# Altium schematic sheet cpu2560-double.SchDoc
size A4
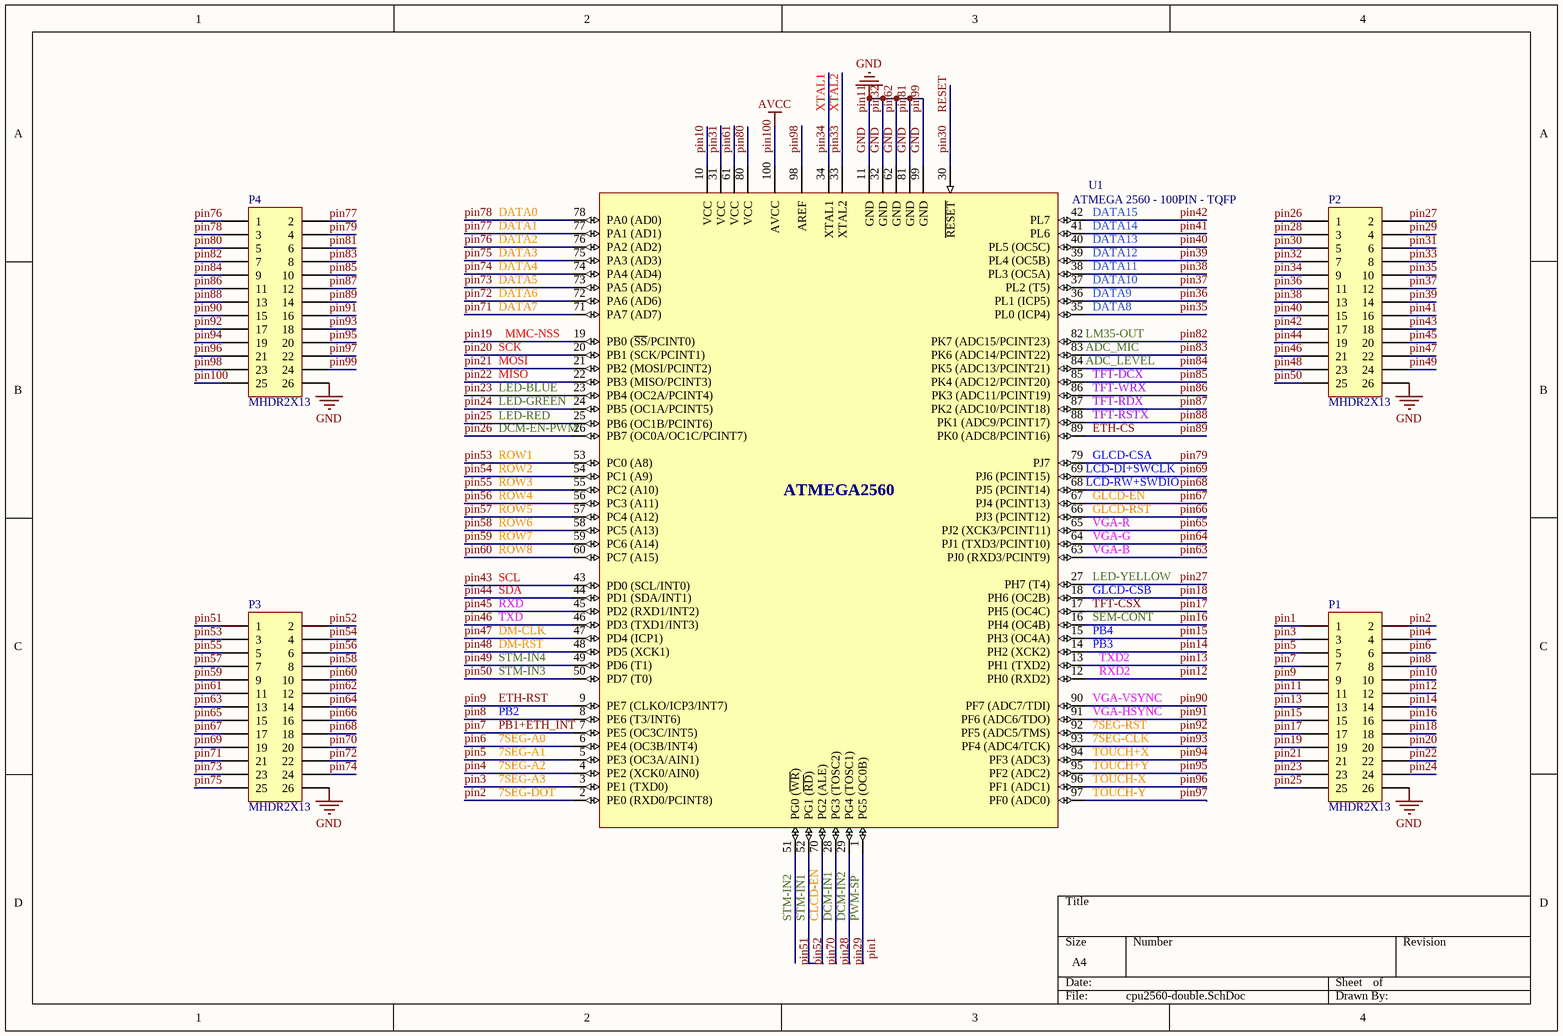
[diagram p0: cpu2560-double.SchDoc]

## Parts
P1  MHDR2X13  [HED-2mm-13X2]
P2  MHDR2X13  [HED-2mm-13X2]
P3  MHDR2X13  [HED-2mm-13X2]
P4  MHDR2X13  [HED-2mm-13X2]
U1  ATMEGA 2560 - 100PIN - TQFP  [Quad100]

## Nets
GND: P1.11 P1.26 P2.7 P2.26 P3.12 P3.26 P4.6 P4.24 P4.26 U1.11(GND) U1.32(GND) U1.62(GND) U1.81(GND) U1.99(GND)  [also labelled pin11, pin32, pin62, pin81, pin99]
pin100: P4.25 U1.100(AVCC)  [also labelled AVCC]
7SEG-A0: P1.6 U1.6(PE4_(OC3B/INT4))  [also labelled pin6]
7SEG-A1: P1.5 U1.5(PE3_(OC3A/AIN1))  [also labelled pin5]
7SEG-A2: P1.4 U1.4(PE2_(XCK0/AIN0))  [also labelled pin4]
7SEG-A3: P1.3 U1.3(PE1_(TXD0))  [also labelled pin3]
7SEG-CLK: P4.18 U1.93(PF4_(ADC4/TCK))  [also labelled pin93]
7SEG-DOT: P1.2 U1.2(PE0_(RXD0/PCINT8))  [also labelled pin2]
7SEG-RST: P4.17 U1.92(PF5_(ADC5/TMS))  [also labelled pin92]
ADC_LEVEL: P4.9 U1.84(PK5_(ADC13/PCINT21))  [also labelled pin84]
ADC_MIC: P4.8 U1.83(PK6_(ADC14/PCINT22))  [also labelled pin83]
CLCD-EN: P3.20 U1.70(PG2_(ALE))  [also labelled pin70]
DATA0: P4.3 U1.78(PA0_(AD0))  [also labelled pin78]
DATA1: P4.2 U1.77(PA1_(AD1))  [also labelled pin77]
DATA2: P4.1 U1.76(PA2_(AD2))  [also labelled pin76]
DATA3: P3.25 U1.75(PA3_(AD3))  [also labelled pin75]
DATA4: P3.24 U1.74(PA4_(AD4))  [also labelled pin74]
DATA5: P3.23 U1.73(PA5_(AD5))  [also labelled pin73]
DATA6: P3.22 U1.72(PA6_(AD6))  [also labelled pin72]
DATA7: P3.21 U1.71(PA7_(AD7))  [also labelled pin71]
DATA8: P2.10 U1.35(PL0_(ICP4))  [also labelled pin35]
DATA9: P2.11 U1.36(PL1_(ICP5))  [also labelled pin36]
DATA10: P2.12 U1.37(PL2_(T5))  [also labelled pin37]
DATA11: P2.13 U1.38(PL3_(OC5A))  [also labelled pin38]
DATA12: P2.14 U1.39(PL4_(OC5B))  [also labelled pin39]
DATA13: P2.15 U1.40(PL5_(OC5C))  [also labelled pin40]
DATA14: P2.16 U1.41(PL6)  [also labelled pin41]
DATA15: P2.17 U1.42(PL7)  [also labelled pin42]
DCM-EN-PWM: P2.1 U1.26(PB7_(OC0A/OC1C/PCINT7))  [also labelled pin26]
DCM-IN1: P2.3 U1.28(PG3_(TOSC2))  [also labelled pin28]
DCM-IN2: P2.4 U1.29(PG4_(TOSC1))  [also labelled pin29]
DM-CLK: P2.22 U1.47(PD4_(ICP1))  [also labelled pin47]
DM-RST: P2.23 U1.48(PD5_(XCK1))  [also labelled pin48]
ETH-CS: P4.14 U1.89(PK0_(ADC8/PCINT16))  [also labelled pin89]
ETH-RST: P1.9 U1.9(PE7_(CLKO/ICP3/INT7))  [also labelled pin9]
GLCD-CSA: P4.4 U1.79(PJ7)  [also labelled pin79]
GLCD-CSB: P1.18 U1.18(PH6_(OC2B))  [also labelled pin18]
GLCD-EN: P3.17 U1.67(PJ4_(PCINT13))  [also labelled pin67]
GLCD-RST: P3.16 U1.66(PJ3_(PCINT12))  [also labelled pin66]
LCD-DI+SWCLK: P3.19 U1.69(PJ6_(PCINT15))  [also labelled pin69]
LCD-RW+SWDIO: P3.18 U1.68(PJ5_(PCINT14))  [also labelled pin68]
LED-BLUE: P1.23 U1.23(PB4_(OC2A/PCINT4))  [also labelled pin23]
LED-GREEN: P1.24 U1.24(PB5_(OC1A/PCINT5))  [also labelled pin24]
LED-RED: P1.25 U1.25(PB6_(OC1B/PCINT6))  [also labelled pin25]
LED-YELLOW: P2.2 U1.27(PH7_(T4))  [also labelled pin27]
LM35-OUT: P4.7 U1.82(PK7_(ADC15/PCINT23))  [also labelled pin82]
MISO: P1.22 U1.22(PB3_(MISO/PCINT3))  [also labelled pin22]
MMC-NSS: P1.19 U1.19(PB0_(~{SS}/PCINT0))  [also labelled pin19]
MOSI: P1.21 U1.21(PB2_(MOSI/PCINT2))  [also labelled pin21]
PB1+ETH_INT: P1.7 U1.7(PE5_(OC3C/INT5))  [also labelled pin7]
PB2: P1.8 U1.8(PE6_(T3/INT6))  [also labelled pin8]
PB3: P1.14 U1.14(PH2_(XCK2))  [also labelled pin14]
PB4: P1.15 U1.15(PH3_(OC4A))  [also labelled pin15]
pin1: P1.1 U1.1(PG5_(OC0B))  [also labelled PWM-SP]
pin10: P1.10 U1.10(VCC)
pin12: P1.12 U1.12(PH0_(RXD2))  [also labelled RXD2]
pin13: P1.13 U1.13(PH1_(TXD2))  [also labelled TXD2]
pin16: P1.16 U1.16(PH4_(OC4B))  [also labelled SEM-CONT]
pin17: P1.17 U1.17(PH5_(OC4C))  [also labelled TFT-CSX]
pin20: P1.20 U1.20(PB1_(SCK/PCINT1))  [also labelled SCK]
pin30: P2.5 U1.30(~{RESET})  [also labelled RESET]
pin31: P2.6 U1.31(VCC)
pin33: P2.8 U1.33(XTAL2)  [also labelled XTAL2]
pin34: P2.9 U1.34(XTAL1)  [also labelled XTAL1]
pin43: P2.18 U1.43(PD0_(SCL/INT0))  [also labelled SCL]
pin44: P2.19 U1.44(PD1_(SDA/INT1))  [also labelled SDA]
pin45: P2.20 U1.45(PD2_(RXD1/INT2))  [also labelled RXD]
pin46: P2.21 U1.46(PD3_(TXD1/INT3))  [also labelled TXD]
pin49: P2.24 U1.49(PD6_(T1))  [also labelled STM-IN4]
pin50: P2.25 U1.50(PD7_(T0))  [also labelled STM-IN3]
pin51: P3.1 U1.51(PG0_(~{WR}))  [also labelled STM-IN2]
pin52: P3.2 U1.52(PG1_(~{RD}))  [also labelled STM-IN1]
pin53: P3.3 U1.53(PC0_(A8))  [also labelled ROW1]
pin54: P3.4 U1.54(PC1_(A9))  [also labelled ROW2]
pin55: P3.5 U1.55(PC2_(A10))  [also labelled ROW3]
pin56: P3.6 U1.56(PC3_(A11))  [also labelled ROW4]
pin57: P3.7 U1.57(PC4_(A12))  [also labelled ROW5]
pin58: P3.8 U1.58(PC5_(A13))  [also labelled ROW6]
pin59: P3.9 U1.59(PC6_(A14))  [also labelled ROW7]
pin60: P3.10 U1.60(PC7_(A15))  [also labelled ROW8]
pin61: P3.11 U1.61(VCC)
pin63: P3.13 U1.63(PJ0_(RXD3/PCINT9))  [also labelled VGA-B]
pin64: P3.14 U1.64(PJ1_(TXD3/PCINT10))  [also labelled VGA-G]
pin65: P3.15 U1.65(PJ2_(XCK3/PCINT11))  [also labelled VGA-R]
pin80: P4.5 U1.80(VCC)
pin85: P4.10 U1.85(PK4_(ADC12/PCINT20))  [also labelled TFT-DCX]
pin86: P4.11 U1.86(PK3_(ADC11/PCINT19))  [also labelled TFT-WRX]
pin87: P4.12 U1.87(PK2_(ADC10/PCINT18))  [also labelled TFT-RDX]
pin88: P4.13 U1.88(PK1_(ADC9/PCINT17))  [also labelled TFT-RSTX]
pin90: P4.15 U1.90(PF7_(ADC7/TDI))  [also labelled VGA-VSYNC]
pin91: P4.16 U1.91(PF6_(ADC6/TDO))  [also labelled VGA-HSYNC]
pin94: P4.19 U1.94(PF3_(ADC3))  [also labelled TOUCH+X]
pin95: P4.20 U1.95(PF2_(ADC2))  [also labelled TOUCH+Y]
pin96: P4.21 U1.96(PF1_(ADC1))  [also labelled TOUCH-X]
pin97: P4.22 U1.97(PF0_(ADC0))  [also labelled TOUCH-Y]
pin98: P4.23 U1.98(AREF)

## Notes on the sheet
- (in symbol ATMEGA 2560) ATMEGA2560

## Library data of the parts
P1-P4 = MHDR2X13: Header, 13-Pin, Dual row; LatestRevisionDate: 17-Jul-2002; LatestRevisionNote: Re-released for DXP Platform.; Publisher: Altium Limited
U1 = ATMEGA 2560